# EAGLE schematic rc_rx_3_3V_with_gyro_iface_and_rear_H-bridge (EAGLE 7.0.0)
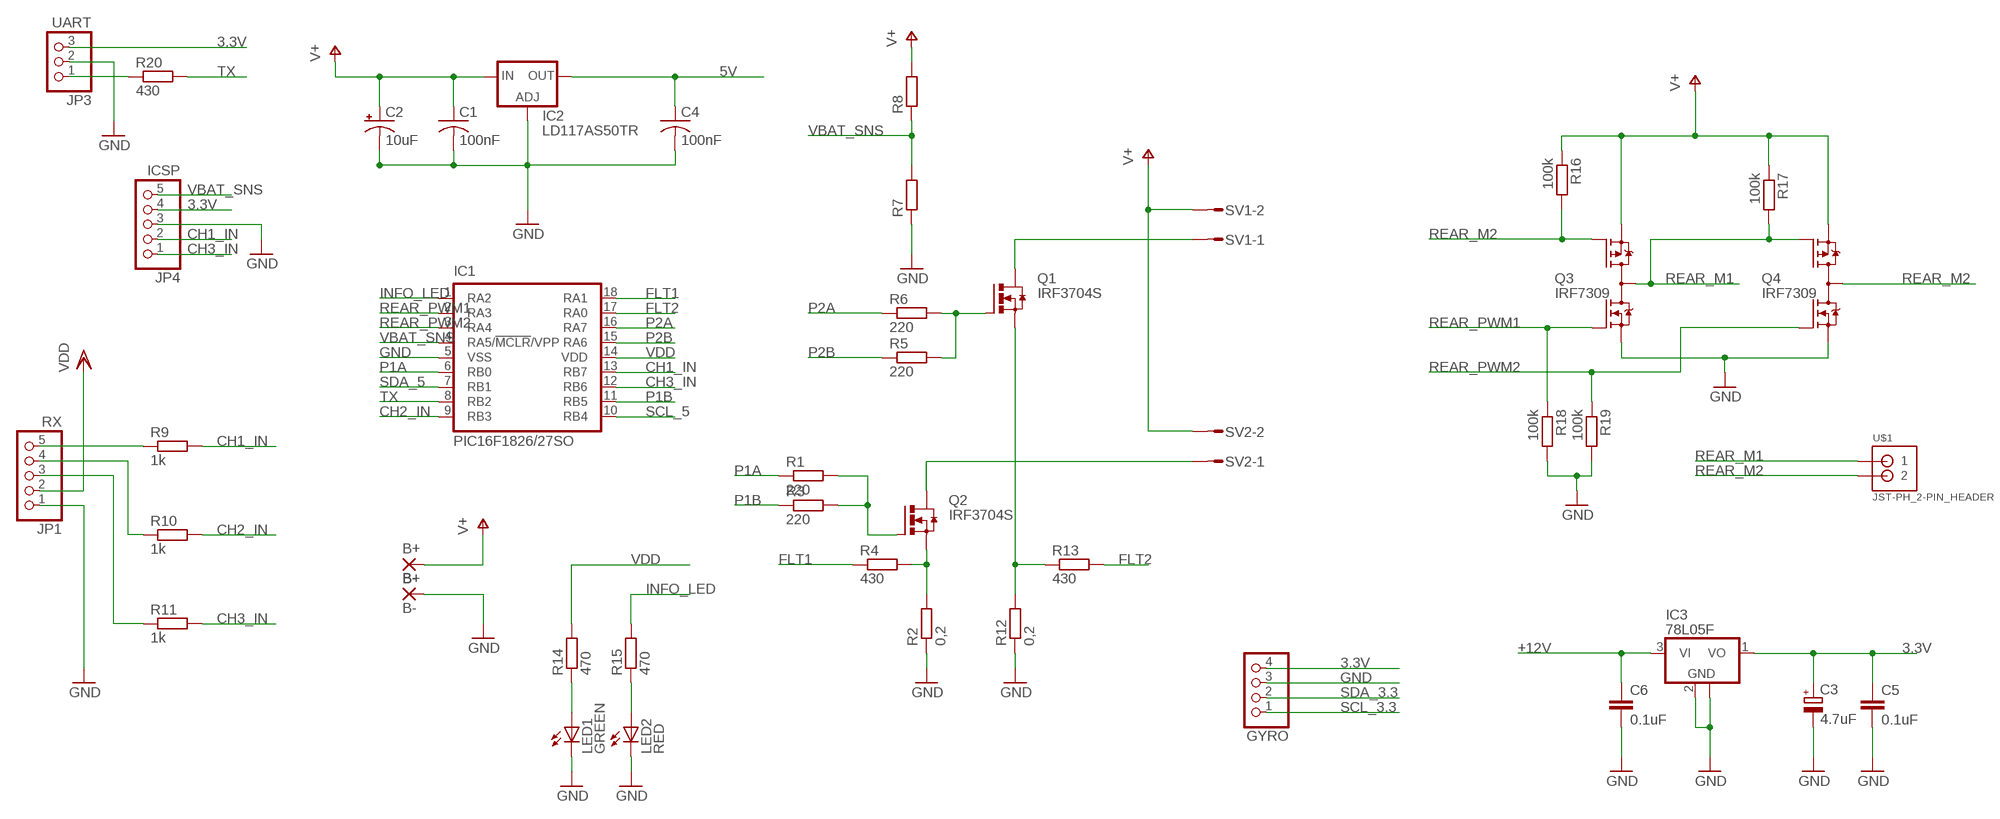
[diagram p0: schematic, sheet 1]

## Parts
B+  B+  3,81/1,4  [3,81/1,4]
B-  B-  3,81/1,4  [3,81/1,4]
C1  100nF  C-USC0805  [C0805]
C2  10uF  CPOL-USE3.5-8  [E3,5-8]
C3  4.7uF  CPOL-EUE1.8-4  [E1,8-4]
C4  100nF  C-USC0805  [C0805]
C5  0.1uF  C-EUC0805  [C0805]
C6  0.1uF  C-EUC0805  [C0805]
GYRO  PINHD-1X4  [1X04]
IC1  PIC16F1826/27SO  [SO-18W]
IC2  LD117AS50TR  [SOT223]
IC3  78L05F  [SOT89]
JP1  RX  PINHD-1X5  [1X05]
JP3  UART  PINHD-1X3  [1X03]
JP4  ICSP  PINHD-1X5  [1X05]
LED1  GREEN  LEDCHIP-LED0603  [CHIP-LED0603]
LED2  RED  LEDCHIP-LED0603  [CHIP-LED0603]
Q1  IRF3704S  [D2PACK]
Q2  IRF3704S  [D2PACK]
Q3  IRF7309  IRF7389  [SO08-IRF]
Q4  IRF7309  IRF7389  [SO08-IRF]
R1  220  R-EU_M0805  [M0805]
R2  0,2  R-EU_M0805  [M0805]
R3  220  R-EU_M0805  [M0805]
R4  430  R-EU_M0805  [M0805]
R5  220  R-EU_R0805  [R0805]
R6  220  R-EU_M0805  [M0805]
R7  R-EU_R0805  [R0805]
R8  R-EU_R0805  [R0805]
R9  1k  R-EU_M0805  [M0805]
R10  1k  R-EU_M0805  [M0805]
R11  1k  R-EU_M0805  [M0805]
R12  0,2  R-EU_M0805  [M0805]
R13  430  R-EU_M0805  [M0805]
R14  470  R-EU_M0805  [M0805]
R15  470  R-EU_M0805  [M0805]
R16  100k  R-EU_M0805  [M0805]
R17  100k  R-EU_M0805  [M0805]
R18  100k  R-EU_M0805  [M0805]
R19  100k  R-EU_M0805  [M0805]
R20  430  R-EU_M0805  [M0805]
SV1  S02P  [S02P]
SV2  S02P  [S02P]
U$1  JST-PH_2-PIN_HEADER  [JST_B2B-PH_HEADER]

## Nets
3.3V: C3.+ C5.1 GYRO.4 IC3.1(VO) JP3.3 JP4.4
5V: C4.1 IC2.4(OUT)
+12V: C6.1 IC3.3(VI)
CH1_IN: IC1.13(RB7) JP4.2 R9.2
CH2_IN: IC1.9(RB3) R10.2
CH3_IN: IC1.12(RB6) JP4.1 R11.2
CRR_SNS: Q1.3(S) R12.2 R13.1
FLT1: IC1.18(RA1) R4.1
FLT2: IC1.17(RA0) R13.2
GND: B-.1(P) C1.2 C2.- C3.- C4.2 C5.2 C6.2 GYRO.3 IC1.5(VSS) IC2.1(ADJ) IC3.2(GND) IC3.2@1(GND) JP1.1 JP3.2 JP4.3 LED1.C LED2.C Q3.1(N-S) Q4.1(N-S) R2.1 R7.1 R12.1 R18.2 R19.2
INFO_LED: IC1.1(RA2) R15.2
N$1: Q2.1(G) R1.2 R3.2
N$2: Q1.1(G) R5.2 R6.2
N$3: Q2.2(D) SV2.1
N$4: Q1.2(D) SV1.1
N$5: JP1.5 R9.1
N$6: JP1.4 R10.1
N$7: JP1.3 R11.1
N$8: Q2.3(S) R2.2 R4.2
N$9: LED1.A R14.1
N$10: LED2.A R15.1
N$11: JP3.1 R20.1
P1A: IC1.6(RB0) R1.1
P1B: IC1.11(RB5) R3.1
P2A: IC1.16(RA7) R6.1
P2B: IC1.15(RA6) R5.1
REAR_M1: Q3.5(D) Q3.6(D) Q3.7(D) Q3.8(D) Q4.4(P-G) R17.2 U$1.P1
REAR_M2: Q3.4(P-G) Q4.5(D) Q4.6(D) Q4.7(D) Q4.8(D) R16.2 U$1.P2
REAR_PWM1: IC1.2(RA3) Q3.2(N-G) R18.1
REAR_PWM2: IC1.3(RA4) Q4.2(N-G) R19.1
SCL_3.3: GYRO.1
SCL_5: IC1.10(RB4)
SDA_3.3: GYRO.2
SDA_5: IC1.7(RB1)
TX: IC1.8(RB2) R20.2
V+: B+.1(P) C1.1 C2.+ IC2.3(IN) Q3.3(P-S) Q4.3(P-S) R8.2 R16.1 R17.1 SV1.2 SV2.2
VBAT_SNS: IC1.4(RA5/!MCLR!/VPP) JP4.5 R7.2 R8.1
VDD: IC1.14(VDD) JP1.2 R14.2

## Library data of the parts
B+ B- = wirepad:3,81/1,4: THROUGH-HOLE PAD
C1 C4 = rcl:C-US: CAPACITOR, American symbol
C2 = rcl:CPOL-US: POLARIZED CAPACITOR, American symbol
C3 = rcl:CPOL-EU: POLARIZED CAPACITOR, European symbol
C5 C6 = rcl:C-EU: CAPACITOR, European symbol
GYRO = pinhead:PINHD-1X4: PIN HEADER
IC1 = microchip:PIC16*F1826/27: 18/20/28-Pin Flash Microcontrollers with nanoWatt XLP Technology Source: www.microchip.com PIC16F1827.pdf
IC2 = v-reg:LD117A?*: Low drop fixed and adjustable positive voltage regulators 1 A Source: http://www.st.com/stonline/products/literature/ds/7194/ld1117axx.pdf
IC3 = linear:78L*: POSITOIV-VOLTAGE REGULATORS Output up to 100 mA Source: http://focus.ti.com/lit/ds/symlink/ua78l05.pdf
JP1 JP4 = pinhead:PINHD-1X5: PIN HEADER
JP3 = pinhead:PINHD-1X3: PIN HEADER
LED1 LED2 = led:LED: LED OSRAM: - CHIPLED LG R971, LG N971, LY N971, LG Q971, LY Q971, LO R971, LY R971 LH N974, LH R974 LS Q976, LO Q976, LY Q976 LO Q996 - Hyper CHIPLED LW Q18S LB Q993, LB Q99A, LB R99A - SideLED LS A670, LO A670, LY A670, LG A670, LP A670 LB A673, LV A673, LT A673, LW A673 LH A674 LY A675 LS A676, LA A676, LO A676, LY A676, LW A676 LS A679, LY A679, LG A679 - Hyper Micro SIDELED® LS Y876, LA Y876, LO Y876, LY Y876 LT Y87S - SmartLED LW L88C, LW L88S LB L89C, LB L89S, LG L890 LS L89K, LO L89K, LY L89K LS L896, LA L896, LO L896, LY L896 - TOPLED LS T670, LO T670, LY T670, LG T670, LP T670 LSG T670, LSP T670, LSY T670, LOP T670, LYG T670 LG T671, LOG T671, LSG T671 LB T673, LV T673, LT T673, LW T673 LH T674 LS T676, LA T676, LO T676, LY T676, LB T676, LH T676, LSB T676, LW T676 LB T67C, LV T67C, LT T67C, LS T67K, LO T67K, LY T67K, LW E67C LS E67B, LA E67B, LO E67B, LY E67B, LB E67C, LV E67C, LT E67C LW T67C LS T679, LY T679, LG T679 LS T770, LO T770, LY T770, LG T770, LP T770 LB T773, LV T773, LT T773, LW T773 LH T774 LS E675, LA E675, LY E675, LS T675 LS T776, LA T776, LO T776, LY T776, LB T776 LHGB T686 LT T68C, LB T68C - Hyper Mini TOPLED® LB M676 - Mini TOPLED Santana® LG M470 LS M47K, LO M47K, LY M47K Source: http://www.osram.convergy.de LUXEON: - LUMILED® LXK2-PW12-R00, LXK2-PW12-S00, LXK2-PW14-U00, LXK2-PW14-V00 LXK2-PM12-R00, LXK2-PM12-S00, LXK2-PM14-U00 LXK2-PE12-Q00, LXK2-PE12-R00, LXK2-PE12-S00, LXK2-PE14-T00, LXK2-PE14-U00 LXK2-PB12-K00, LXK2-PB12-L00, LXK2-PB12-M00, LXK2-PB14-N00, LXK2-PB14-P00, LXK2-PB14-Q00 LXK2-PR12-L00, LXK2-PR12-M00, LXK2-PR14-Q00, LXK2-PR14-R00 LXK2-PD12-Q00, LXK2-PD12-R00, LXK2-PD12-S00 LXK2-PH12-R00, LXK2-PH12-S00 LXK2-PL12-P00, LXK2-PL12-Q00, LXK2-PL12-R00 Source: www.luxeon.com KINGBRIGHT: KA-3528ASYC Source: www.kingbright.com
Q1 Q2 = transistor-power:IRF3704: SMPS MOSFET HEXFET® Power MOSFET Source: http://www.irf.com/product-info/datasheets/data/irf3704.pdf
Q3 Q4 = transistor-fet:IRF7389: Complimentary Half Bridge HEXFET Power MOSFET Source: http://www.irf.com/product-info/datasheets/data/irf7389.pdf
R1-R20 = resistor:R-EU_: RESISTOR, European symbol
SV1 SV2 = con-amp-mt:S02P: AMP MT CONNECTOR; OC_FARNELL: unknown; OC_NEWARK: unknown
U$1 = SRG:JST-PH_2-PIN_HEADER: 2-pin JST PH Shrouded Header, top entry P/N B2B-PH-K-S Mating connector PHR-2 Mating cable assembly: Sparkfun PRT-09914 <http://www.sparkfun.com/products/9914>